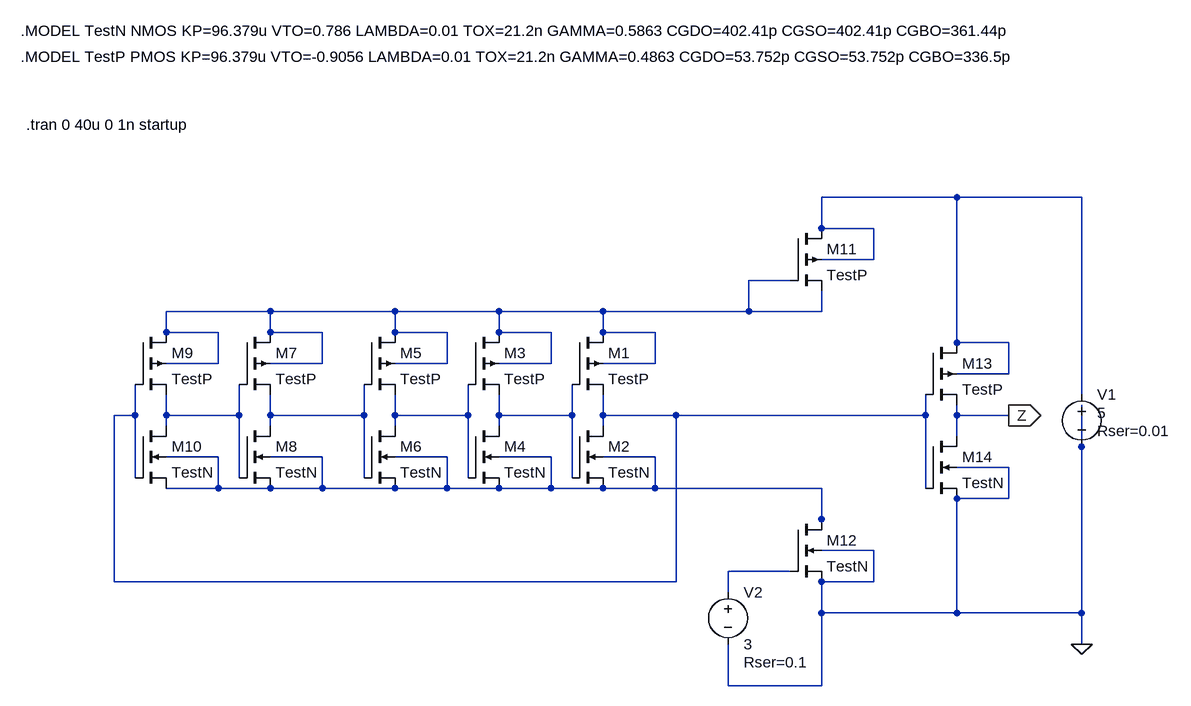
[diagram p0: schematic exp4_VcoSimulation - Copy.asc]
exp4_VcoSimulation - Copy.asc, the LTspice schematic file:
Version 4
SHEET 1 952 720
WIRE 128 -112 -80 -112
WIRE 320 -112 128 -112
WIRE -80 -64 -80 -112
WIRE 0 -64 -80 -64
WIRE -80 -48 -80 -64
WIRE 0 -16 0 -64
WIRE 0 -16 -80 -16
WIRE -128 16 -192 16
WIRE -928 64 -1088 64
WIRE -736 64 -928 64
WIRE -576 64 -736 64
WIRE -416 64 -576 64
WIRE -192 64 -192 16
WIRE -192 64 -416 64
WIRE -80 64 -80 32
WIRE -80 64 -192 64
WIRE -1088 96 -1088 64
WIRE -1008 96 -1088 96
WIRE -928 96 -928 64
WIRE -848 96 -928 96
WIRE -736 96 -736 64
WIRE -656 96 -736 96
WIRE -576 96 -576 64
WIRE -496 96 -576 96
WIRE -416 96 -416 64
WIRE -336 96 -416 96
WIRE -1088 112 -1088 96
WIRE -928 112 -928 96
WIRE -736 112 -736 96
WIRE -576 112 -576 96
WIRE -416 112 -416 96
WIRE 128 112 128 -112
WIRE 208 112 128 112
WIRE 128 128 128 112
WIRE -1008 144 -1008 96
WIRE -1008 144 -1088 144
WIRE -848 144 -848 96
WIRE -848 144 -928 144
WIRE -656 144 -656 96
WIRE -656 144 -736 144
WIRE -496 144 -496 96
WIRE -496 144 -576 144
WIRE -336 144 -336 96
WIRE -336 144 -416 144
WIRE 208 160 208 112
WIRE 208 160 128 160
WIRE 320 192 320 -112
WIRE -1136 224 -1136 176
WIRE -1136 224 -1168 224
WIRE -1088 224 -1088 192
WIRE -976 224 -976 176
WIRE -976 224 -1088 224
WIRE -928 224 -928 192
WIRE -784 224 -784 176
WIRE -784 224 -928 224
WIRE -736 224 -736 192
WIRE -624 224 -624 176
WIRE -624 224 -736 224
WIRE -576 224 -576 192
WIRE -464 224 -464 176
WIRE -464 224 -576 224
WIRE -416 224 -416 192
WIRE -304 224 -416 224
WIRE 80 224 80 192
WIRE 80 224 -304 224
WIRE 128 224 128 208
WIRE 208 224 128 224
WIRE -1088 240 -1088 224
WIRE -928 240 -928 224
WIRE -736 240 -736 224
WIRE -576 240 -576 224
WIRE -416 240 -416 224
WIRE 128 256 128 224
WIRE 320 272 320 208
WIRE -1008 288 -1088 288
WIRE -848 288 -928 288
WIRE -656 288 -736 288
WIRE -496 288 -576 288
WIRE -336 288 -416 288
WIRE 208 304 128 304
WIRE -1136 320 -1136 224
WIRE -976 320 -976 224
WIRE -784 320 -784 224
WIRE -624 320 -624 224
WIRE -464 320 -464 224
WIRE -1008 336 -1008 288
WIRE -1008 336 -1088 336
WIRE -928 336 -1008 336
WIRE -848 336 -848 288
WIRE -848 336 -928 336
WIRE -736 336 -848 336
WIRE -656 336 -656 288
WIRE -656 336 -736 336
WIRE -576 336 -656 336
WIRE -496 336 -496 288
WIRE -496 336 -576 336
WIRE -416 336 -496 336
WIRE -336 336 -336 288
WIRE -336 336 -416 336
WIRE -80 336 -336 336
WIRE 80 336 80 224
WIRE 208 352 208 304
WIRE 208 352 128 352
WIRE -80 384 -80 336
WIRE -80 400 -80 384
WIRE 0 432 -80 432
WIRE -128 464 -224 464
WIRE -1168 480 -1168 224
WIRE -304 480 -304 224
WIRE -304 480 -1168 480
WIRE 0 480 0 432
WIRE 0 480 -80 480
WIRE -224 496 -224 464
WIRE -80 528 -80 480
WIRE 128 528 128 352
WIRE 128 528 -80 528
WIRE 320 528 320 272
WIRE 320 528 128 528
WIRE 320 576 320 528
WIRE -224 640 -224 576
WIRE -80 640 -80 528
WIRE -80 640 -224 640
FLAG 208 224 Z
IOPIN 208 224 Out
FLAG 320 576 0
SYMBOL pmos4 -464 96 R0
SYMATTR InstName M1
SYMATTR Value2 l=10u w=40u
SYMATTR Value TestP
SYMBOL nmos4 -464 240 R0
SYMATTR InstName M2
SYMATTR Value2 l=10u w=20u
SYMATTR Value TestN
SYMBOL pmos4 -624 96 R0
SYMATTR InstName M3
SYMATTR Value2 l=10u w=40u
SYMATTR Value TestP
SYMBOL nmos4 -624 240 R0
SYMATTR InstName M4
SYMATTR Value2 l=10u w=20u
SYMATTR Value TestN
SYMBOL pmos4 -784 96 R0
SYMATTR InstName M5
SYMATTR Value2 l=10u w=40u
SYMATTR Value TestP
SYMBOL nmos4 -784 240 R0
SYMATTR InstName M6
SYMATTR Value2 l=10u w=20u
SYMATTR Value TestN
SYMBOL pmos4 -976 96 R0
SYMATTR InstName M7
SYMATTR Value2 l=10u w=40u
SYMATTR Value TestP
SYMBOL nmos4 -976 240 R0
SYMATTR InstName M8
SYMATTR Value2 l=10u w=20u
SYMATTR Value TestN
SYMBOL pmos4 -1136 96 R0
SYMATTR InstName M9
SYMATTR Value2 l=10u w=40u
SYMATTR Value TestP
SYMBOL nmos4 -1136 240 R0
SYMATTR InstName M10
SYMATTR Value2 l=10u w=20u
SYMATTR Value TestN
SYMBOL voltage 320 176 R0
WINDOW 3 24 44 Left 2
WINDOW 123 0 0 Left 2
WINDOW 39 24 72 Left 2
SYMATTR Value 5
SYMATTR SpiceLine Rser=0.01
SYMATTR InstName V1
SYMBOL pmos4 -128 -64 R0
SYMATTR InstName M11
SYMATTR Value2 l=10u w=200u
SYMATTR Value TestP
SYMBOL nmos4 -128 384 R0
SYMATTR InstName M12
SYMATTR Value2 l=10u w=100u
SYMATTR Value TestN
SYMBOL pmos4 80 112 R0
SYMATTR InstName M13
SYMATTR Value2 l=10u w=40u
SYMATTR Value TestP
SYMBOL nmos4 80 256 R0
SYMATTR InstName M14
SYMATTR Value2 l=10u w=20u
SYMATTR Value TestN
SYMBOL voltage -224 480 R0
WINDOW 123 0 0 Left 0
WINDOW 39 24 124 Left 2
SYMATTR InstName V2
SYMATTR Value 3
SYMATTR SpiceLine Rser=0.1
TEXT -1312 -368 Left 2 !.MODEL TestN NMOS KP=96.379u VTO=0.786 LAMBDA=0.01 TOX=21.2n GAMMA=0.5863 CGDO=402.41p CGSO=402.41p CGBO=361.44p
TEXT -1312 -328 Left 2 !.MODEL TestP PMOS KP=96.379u VTO=-0.9056 LAMBDA=0.01 TOX=21.2n GAMMA=0.4863 CGDO=53.752p CGSO=53.752p CGBO=336.5p
TEXT -1304 -224 Left 2 !.tran 0 40u 0 1n startup

The netlist it stands for:
* exp4_VcoSimulation - Copy.asc
M1 N002 N007 N003 N002 TestP l=10u w=40u
M2 N003 N007 N008 N008 TestN l=10u w=20u
M3 N002 N006 N007 N002 TestP l=10u w=40u
M4 N007 N006 N008 N008 TestN l=10u w=20u
M5 N002 N005 N006 N002 TestP l=10u w=40u
M6 N006 N005 N008 N008 TestN l=10u w=20u
M7 N002 N004 N005 N002 TestP l=10u w=40u
M8 N005 N004 N008 N008 TestN l=10u w=20u
M9 N002 N003 N004 N002 TestP l=10u w=40u
M10 N004 N003 N008 N008 TestN l=10u w=20u
V1 N001 0 5 Rser=0.01
M11 N001 N002 N002 N001 TestP l=10u w=200u
M12 N008 N009 0 0 TestN l=10u w=100u
M13 N001 N003 Z N001 TestP l=10u w=40u
M14 Z N003 0 0 TestN l=10u w=20u
V2 N009 0 3 Rser=0.1
.model NMOS NMOS
.model PMOS PMOS
.lib standard.mos
.MODEL TestN NMOS KP=96.379u VTO=0.786 LAMBDA=0.01 TOX=21.2n GAMMA=0.5863 CGDO=402.41p CGSO=402.41p CGBO=361.44p
.MODEL TestP PMOS KP=96.379u VTO=-0.9056 LAMBDA=0.01 TOX=21.2n GAMMA=0.4863 CGDO=53.752p CGSO=53.752p CGBO=336.5p
.tran 0 40u 0 1n startup
.backanno
.end